# EAGLE design GOTOWAPŁYTKA (EAGLE 9.6.2)
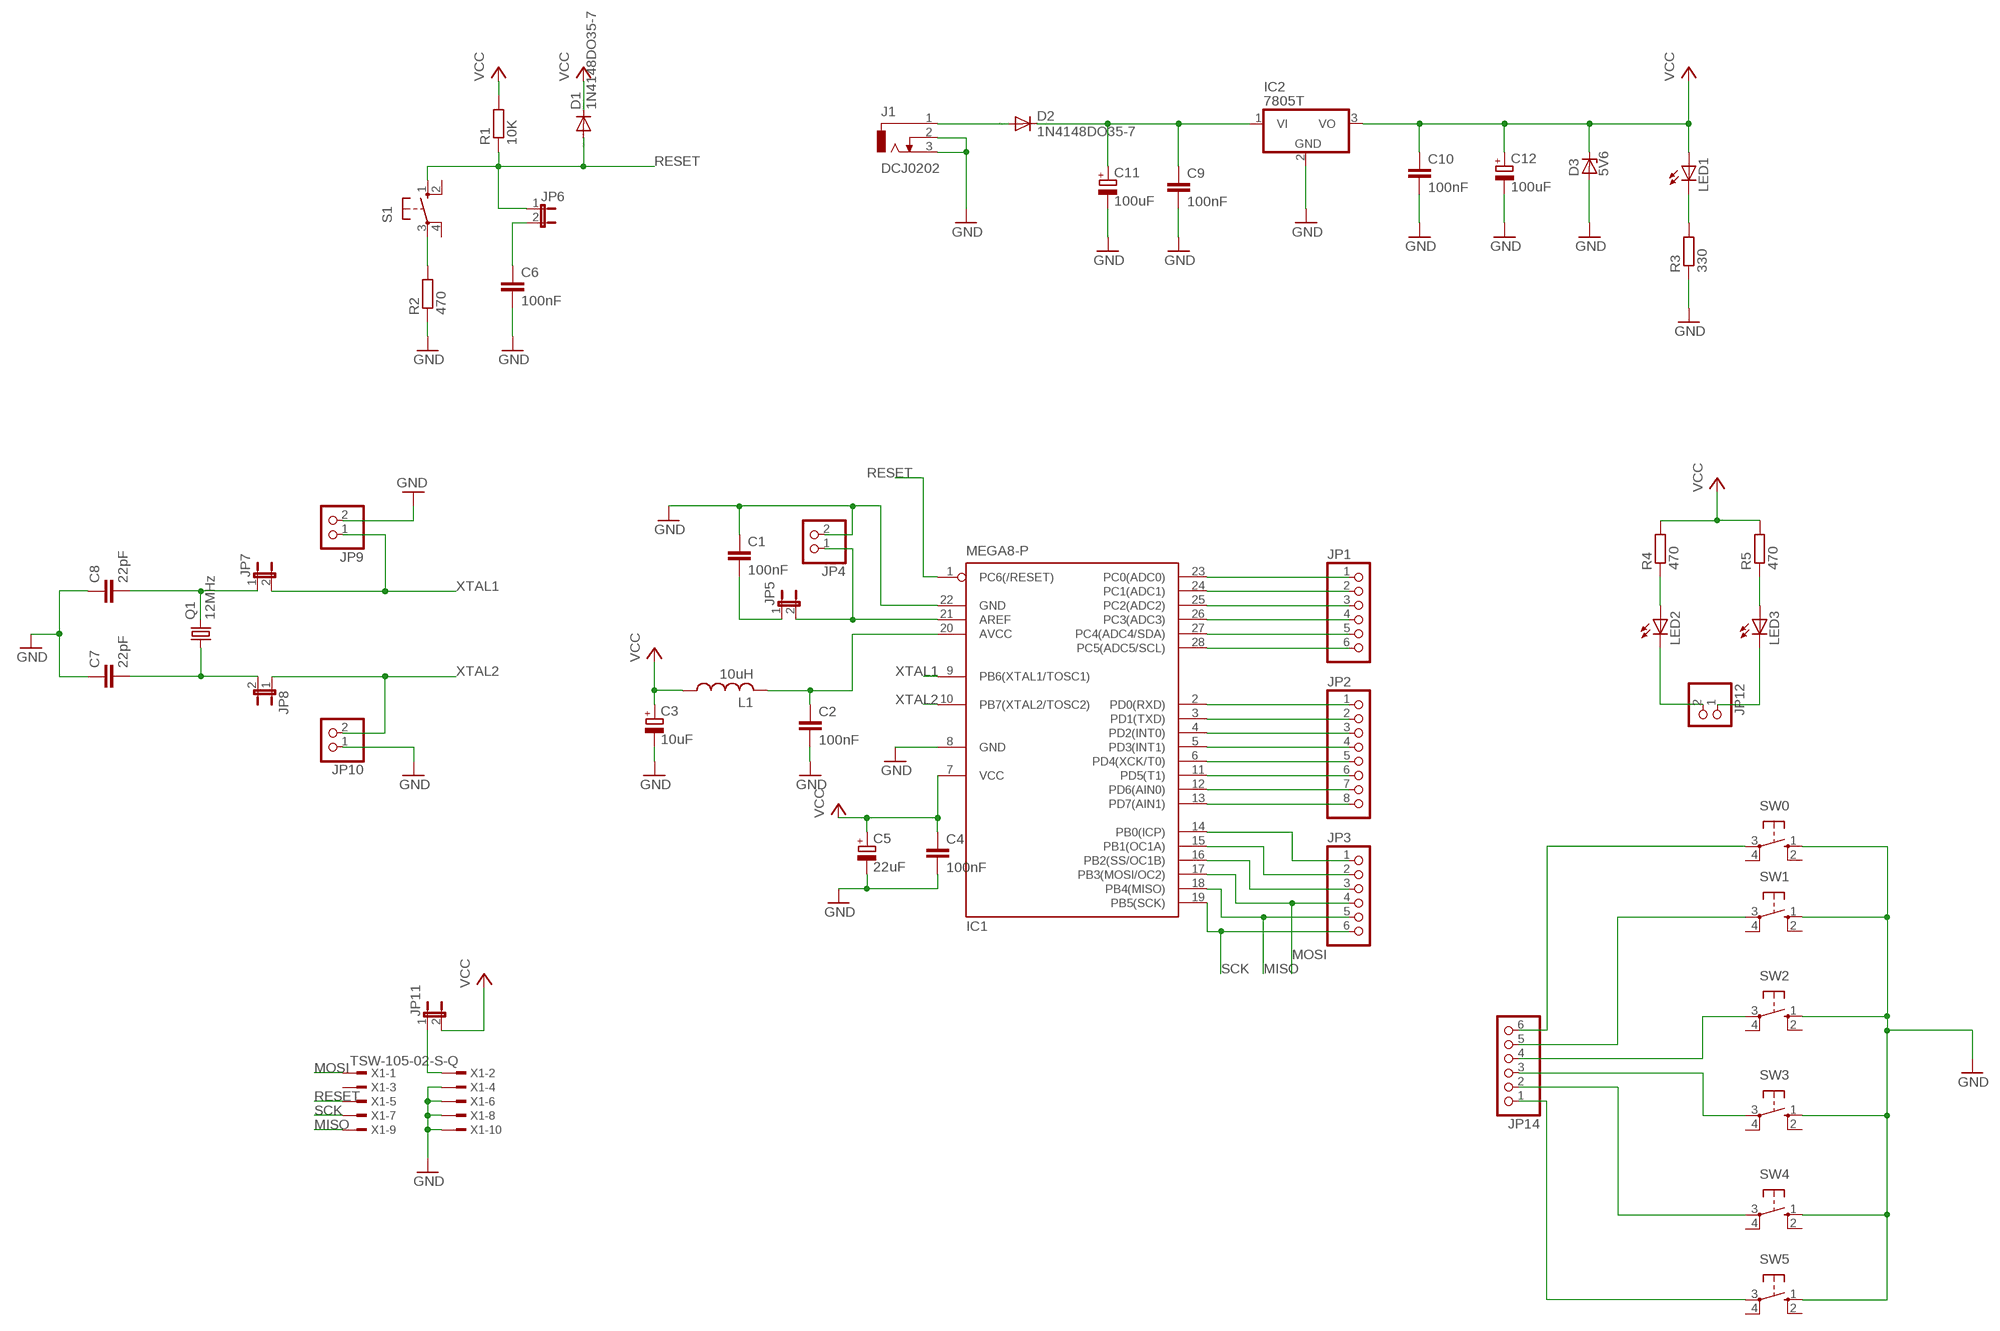
[diagram p0: schematic, sheet 1]

## Parts
C1  100nF  C-EU025-025X050  [C025-025X050]
C2  100nF  C-EU025-025X050  [C025-025X050]
C3  10uF  CPOL-EUB45181B  [B45181B]
C4  100nF  C-EU025-025X050  [C025-025X050]
C5  22uF  CPOL-EUB45181B  [B45181B]
C6  100nF  C-EU025-025X050  [C025-025X050]
C7  22pF  C-EU025-025X050  [C025-025X050]
C8  22pF  C-EU025-025X050  [C025-025X050]
C9  100nF  C-EU025-025X050  [C025-025X050]
C10  100nF  C-EU025-025X050  [C025-025X050]
C11  100uF  CPOL-EUB45181B  [B45181B]
C12  100uF  CPOL-EUB45181B  [B45181B]
D1  1N4148DO35-7  [DO35-7]
D2  1N4148DO35-7  [DO35-7]
D3  5V6  ZENER-DIODEC1702-15  [C1702-15]
IC1  MEGA8-P  [DIL28-3]
IC2  7805T  [TO220H]
J1  DCJ0202  [DCJ0202]
JP1  PINHD-1X6  [1X06]
JP2  PINHD-1X8  [1X08]
JP3  PINHD-1X6  [1X06]
JP4  PINHD-1X2  [1X02]
JP5  JP1E  [JP1]
JP6  JP1E  [JP1]
JP7  JP1E  [JP1]
JP8  JP1E  [JP1]
JP9  PINHD-1X2  [1X02]
JP10  PINHD-1X2  [1X02]
JP11  JP1E  [JP1]
JP12  PINHD-1X2  [1X02]
JP14  PINHD-1X6  [1X06]
L1  10uH  L-US0204/7  [0204/7]
LED1  LED5MM  [LED5MM]
LED2  LED5MM  [LED5MM]
LED3  LED5MM  [LED5MM]
Q1  12MHz  CRYSTALHC49U-V  [HC49U-V]
R1  10K  R-EU_0204/7  [0204/7]
R2  470  R-EU_0204/7  [0204/7]
R3  330  R-EU_0204/7  [0204/7]
R4  470  R-EU_0204/7  [0204/7]
R5  470  R-EU_0204/7  [0204/7]
S1  10-XX  [B3F-10XX]
SW0  10-XX  [B3F-10XX]
SW1  10-XX  [B3F-10XX]
SW2  10-XX  [B3F-10XX]
SW3  10-XX  [B3F-10XX]
SW4  10-XX  [B3F-10XX]
SW5  10-XX  [B3F-10XX]
X1  TSW-105-02-S-Q  [TSW-105-02-S-Q]

## Nets
GND: C1.1 C2.2 C3.- C4.2 C5.- C6.2 C7.1 C8.1 C9.2 C10.2 C11.- C12.- D3.A IC1.8(GND) IC1.22(GND) IC2.2(GND) J1.2 J1.3 JP4.2 JP9.2 JP10.1 R2.1 R3.1 SW0.1(S) SW1.1(S) SW2.1(S) SW3.1(S) SW4.1(S) SW5.1(S) X1.4 X1.6 X1.8 X1.10
MISO: IC1.18(PB4(MISO)) JP3.5 X1.9
MOSI: IC1.17(PB3(MOSI/OC2)) JP3.4 X1.1
N$1: C2.1 IC1.20(AVCC) L1.2
N$2: C8.2 JP7.1 Q1.2
N$3: C7.2 JP8.2 Q1.1
N$4: JP11.1 X1.2
N$5: IC1.21(AREF) JP4.1 JP5.2
N$6: C1.2 JP5.1
N$7: LED1.K(C) R3.2
N$8: D2.A J1.1
N$9: IC1.23(PC0(ADC0)) JP1.1
N$10: IC1.24(PC1(ADC1)) JP1.2
N$11: IC1.25(PC2(ADC2)) JP1.3
N$12: IC1.26(PC3(ADC3)) JP1.4
N$13: IC1.27(PC4(ADC4/SDA)) JP1.5
N$14: IC1.28(PC5(ADC5/SCL)) JP1.6
N$15: IC1.2(PD0(RXD)) JP2.1
N$16: IC1.3(PD1(TXD)) JP2.2
N$17: IC1.4(PD2(INT0)) JP2.3
N$18: IC1.5(PD3(INT1)) JP2.4
N$19: IC1.6(PD4(XCK/T0)) JP2.5
N$20: IC1.11(PD5(T1)) JP2.6
N$21: IC1.12(PD6(AIN0)) JP2.7
N$22: IC1.13(PD7(AIN1)) JP2.8
N$23: IC1.14(PB0(ICP)) JP3.1
N$24: IC1.15(PB1(OC1A)) JP3.2
N$25: IC1.16(PB2(SS/OC1B)) JP3.3
N$26: C9.1 C11.+ D2.C IC2.1(VI)
N$27: JP12.1 LED3.K(C)
N$28: LED3.A R5.1
N$29: R2.2 S1.3(P)
N$30: C6.1 JP6.2
N$31: JP12.2 LED2.K(C)
N$32: LED2.A R4.1
N$33: JP14.5 SW1.3(P)
N$34: JP14.4 SW2.3(P)
N$35: JP14.3 SW3.3(P)
N$36: JP14.2 SW4.3(P)
N$38: JP14.6 SW0.3(P)
N$39: JP14.1 SW5.3(P)
RESET: D1.A IC1.1(PC6(/RESET)) JP6.1 R1.1 S1.1(S) X1.5
SCK: IC1.19(PB5(SCK)) JP3.6 X1.7
VCC: C3.+ C4.1 C5.+ C10.1 C12.+ D1.C D3.C IC1.7(VCC) IC2.3(VO) JP11.2 L1.1 LED1.A R1.2 R4.2 R5.2
XTAL1: IC1.9(PB6(XTAL1/TOSC1)) JP7.2 JP9.1
XTAL2: IC1.10(PB7(XTAL2/TOSC2)) JP8.1 JP10.2
Unconnected: S1.2(S1) S1.4(P1) SW0.2(S1) SW0.4(P1) SW1.2(S1) SW1.4(P1) SW2.2(S1) SW2.4(P1) SW3.2(S1) SW3.4(P1) SW4.2(S1) SW4.4(P1) SW5.2(S1) SW5.4(P1) X1.3

## Library data of the parts
C1 = rcl:C-EU: CAPACITOR, European symbol
C2 C4 C6-C10 = resistor:C-EU: CAPACITOR, European symbol
C3 C5 C11 C12 = resistor:CPOL-EU: POLARIZED CAPACITOR, European symbol
D1 D2 = diode:1N4148: DIODE high speed (Philips)
D3 = diode:ZENER-DIODE: Z-Diode
IC1 = atmel:MEGA8-P: MICROCONTROLLER 8 Kbytes FLASH, 1 kbytes SRAM, 512 bytes EEPROM, USART, 4-channel 10 bit ADC, 2-channel 8 bit ADC Pin compatible with Atmega48, ATMega88, ATMega168 Source: avr.lbr; OC_FARNELL: unknown; OC_NEWARK: unknown
IC2 = linear:78*: Positive VOLTAGE REGULATOR Source: http://cache.national.com/ds/LM/LM78L05.pdf http://www.fairchildsemi.com/ds/LM/LM7805.pdf
J1 = con-jack:DCJ0202: DC POWER JACK Source: DCJ0202.pdf; OC_FARNELL: unknown; OC_NEWARK: unknown
JP1 JP3 JP14 = pinhead:PINHD-1X6: PIN HEADER
JP2 = pinhead:PINHD-1X8: PIN HEADER
JP4 JP9 JP10 JP12 = pinhead:PINHD-1X2: PIN HEADER
JP5-JP8 JP11 = jumper:JP1E: JUMPER
L1 = rcl:L-US: INDUCTOR, American symbol
LED1-LED3 = led:LED: LED OSRAM: - CHIPLED LG R971, LG N971, LY N971, LG Q971, LY Q971, LO R971, LY R971 LH N974, LH R974 LS Q976, LO Q976, LY Q976 LO Q996 - Hyper CHIPLED LW Q18S LB Q993, LB Q99A, LB R99A - SideLED LS A670, LO A670, LY A670, LG A670, LP A670 LB A673, LV A673, LT A673, LW A673 LH A674 LY A675 LS A676, LA A676, LO A676, LY A676, LW A676 LS A679, LY A679, LG A679 - Hyper Micro SIDELED® LS Y876, LA Y876, LO Y876, LY Y876 LT Y87S - SmartLED LW L88C, LW L88S LB L89C, LB L89S, LG L890 LS L89K, LO L89K, LY L89K LS L896, LA L896, LO L896, LY L896 - TOPLED LS T670, LO T670, LY T670, LG T670, LP T670 LSG T670, LSP T670, LSY T670, LOP T670, LYG T670 LG T671, LOG T671, LSG T671 LB T673, LV T673, LT T673, LW T673 LH T674 LS T676, LA T676, LO T676, LY T676, LB T676, LH T676, LSB T676, LW T676 LB T67C, LV T67C, LT T67C, LS T67K, LO T67K, LY T67K, LW E67C LS E67B, LA E67B, LO E67B, LY E67B, LB E67C, LV E67C, LT E67C LW T67C LS T679, LY T679, LG T679 LS T770, LO T770, LY T770, LG T770, LP T770 LB T773, LV T773, LT T773, LW T773 LH T774 LS E675, LA E675, LY E675, LS T675 LS T776, LA T776, LO T776, LY T776, LB T776 LHGB T686 LT T68C, LB T68C - Hyper Mini TOPLED® LB M676 - Mini TOPLED Santana® LG M470 LS M47K, LO M47K, LY M47K Source: http://www.osram.convergy.de LUXEON: - LUMILED® LXK2-PW12-R00, LXK2-PW12-S00, LXK2-PW14-U00, LXK2-PW14-V00 LXK2-PM12-R00, LXK2-PM12-S00, LXK2-PM14-U00 LXK2-PE12-Q00, LXK2-PE12-R00, LXK2-PE12-S00, LXK2-PE14-T00, LXK2-PE14-U00 LXK2-PB12-K00, LXK2-PB12-L00, LXK2-PB12-M00, LXK2-PB14-N00, LXK2-PB14-P00, LXK2-PB14-Q00 LXK2-PR12-L00, LXK2-PR12-M00, LXK2-PR14-Q00, LXK2-PR14-R00 LXK2-PD12-Q00, LXK2-PD12-R00, LXK2-PD12-S00 LXK2-PH12-R00, LXK2-PH12-S00 LXK2-PL12-P00, LXK2-PL12-Q00, LXK2-PL12-R00 Source: www.luxeon.com KINGBRIGHT: KA-3528ASYC Source: www.kingbright.com
Q1 = crystal:CRYSTAL: CRYSTAL; OC_FARNELL: 1666969; OC_NEWARK: unknown
R1-R5 = rcl:R-EU_: RESISTOR, European symbol
S1 SW0 SW1-SW5 = switch-omron:10-XX: OMRON SWITCH; MPN: B3F-1000; OC_FARNELL: 176432; OC_NEWARK: 36M3542
X1 = con-samtec:TSW-105-02-S-Q: THROUGH-HOLE .025" SQ POST HEADER Source: Samtec TSW.pdf; OC_FARNELL: unknown; OC_NEWARK: unknown

## Board
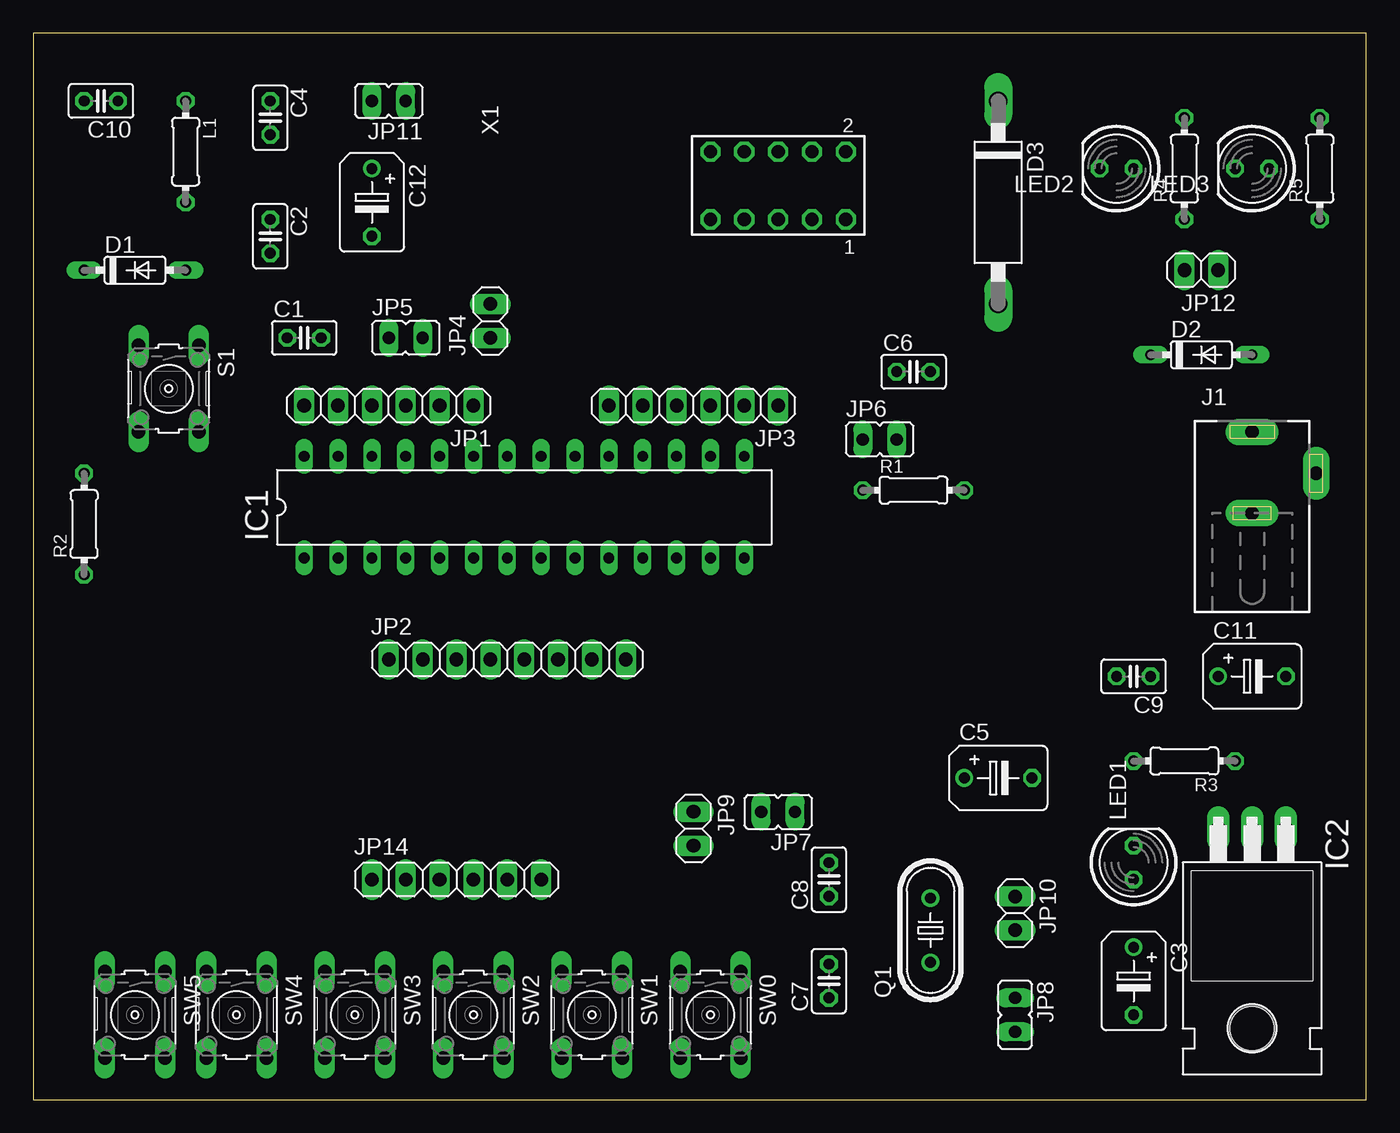
[diagram p1: board, top side]
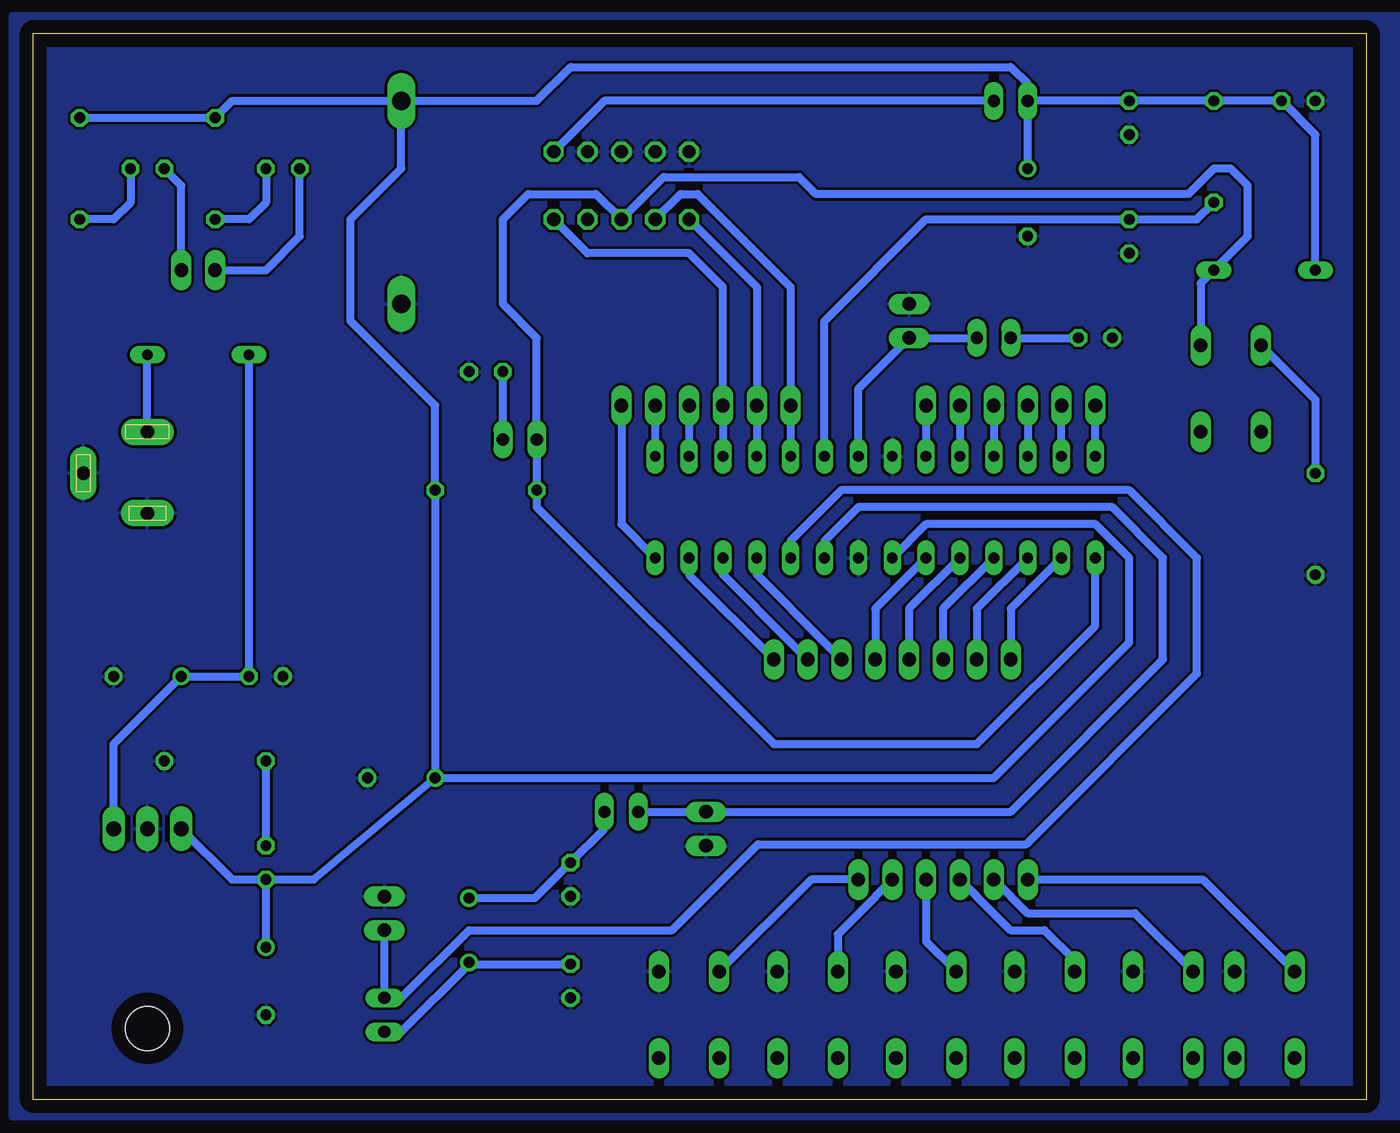
[diagram p2: board, bottom side, seen from below]

Size 100 x 80 mm. Coordinates in mm from the lower left corner, seen from the top.
Outline: 0,0 100,0 100,80 0,80 0,0
Copper layers (1*16): Top 0.035mm / dielectric 1.5mm / Bottom 0.035mm
Design rules "default": minimum track width 10mil, minimum drill 24mil, track to track 8mil, track to pad 8mil, pad to pad 8mil, via to via 8mil, smd to smd 8mil, copper to edge 40mil, drill to drill 8mil, minimum pad ring 10mil, minimum via ring 8mil, stop-mask expansion 4mil, vias tented up to drill 0mil, thermal gap 10mil

### Footprints (pad centres in the part's own frame; a part is rotated, then mirrored left to right if it is on the bottom)
C025-025X050 = drill 0.813 octagon: 1 -1.27,0; 2 1.27,0
B45181B = drill 0.813: + -2.54,0 | drill 0.813 octagon: - 2.54,0
DO35-7 = drill 0.813 long: A 3.81,0; C -3.81,0
C1702-15 = drill 1.397 long: A 7.62,0; C -7.62,0
DIL28-3 = drill 0.813 long: 1 -16.51,-3.81; 2 -13.97,-3.81; 3 -11.43,-3.81; 4 -8.89,-3.81; 5 -6.35,-3.81; 6 -3.81,-3.81; 7 -1.27,-3.81; 8 1.27,-3.81; 9 3.81,-3.81; 10 6.35,-3.81; 11 8.89,-3.81; 12 11.43,-3.81; 13 13.97,-3.81; 14 16.51,-3.81; 15 16.51,3.81; 16 13.97,3.81; 17 11.43,3.81; 18 8.89,3.81; 19 6.35,3.81; 20 3.81,3.81; 21 1.27,3.81; 22 -1.27,3.81; 23 -3.81,3.81; 24 -6.35,3.81; 25 -8.89,3.81; 26 -11.43,3.81; 27 -13.97,3.81; 28 -16.51,3.81
TO220H = drill 1.118 long: 1 -2.54,-10.16; 2 0,-10.16; 3 2.54,-10.16 | hole 3.302: 0,4.826
DCJ0202 = drill 1 pad 2 long: 1 0,3.1; 2 4.8,0; 3 0,-3
1X06 = drill 1.016 long: 1 -6.35,0; 2 -3.81,0; 3 -1.27,0; 4 1.27,0; 5 3.81,0; 6 6.35,0
1X08 = drill 1.016 long: 1 -8.89,0; 2 -6.35,0; 3 -3.81,0; 4 -1.27,0; 5 1.27,0; 6 3.81,0; 7 6.35,0; 8 8.89,0
1X02 = drill 1.016 long: 1 -1.27,0; 2 1.27,0
JP1 = drill 0.914 long: 1 0,-1.27; 2 0,1.27
0204/7 = drill 0.813 octagon: 1 -3.81,0; 2 3.81,0
LED5MM = drill 0.813 octagon: A -1.27,0; K 1.27,0
HC49U-V = drill 0.813: 1 -2.413,0; 2 2.413,0
B3F-10XX = drill 1.016 long: 1 -3.251,2.261; 2 3.251,2.261; 3 -3.251,-2.261; 4 3.251,-2.261
TSW-105-02-S-Q = drill 1 pad 1.5 octagon: 1 5.08,-2.54; 2 5.08,2.54; 3 2.54,-2.54; 4 2.54,2.54; 5 0,-2.54; 6 0,2.54; 7 -2.54,-2.54; 8 -2.54,2.54; 9 -5.08,-2.54; 10 -5.08,2.54

### Placement (x,y rotation side)
C1  20.32,57.15 0 top
C2  17.78,64.77 270 top
C3  82.55,8.89 270 top
C4  17.78,73.66 270 top
C5  72.39,24.13 0 top
C6  66.04,54.61 0 top
C7  59.69,8.89 90 top
C8  59.69,16.51 90 top
C9  82.55,31.75 180 top
C10  5.08,74.93 180 top
C11  91.44,31.75 0 top
C12  25.4,67.31 270 top
D1  7.62,62.23 0 top
D2  87.63,55.88 0 top
D3  72.39,67.31 270 top
IC1  36.83,44.45 0 top
IC2  91.44,10.16 180 top
J1  91.44,46.99 0 top
JP1  26.67,52.07 180 top
JP2  35.56,33.02 0 top
JP3  49.53,52.07 180 top
JP4  34.29,58.42 90 top
JP5  27.94,57.15 270 top
JP6  63.5,49.53 270 top
JP7  55.88,21.59 90 top
JP8  73.66,6.35 180 top
JP9  49.53,20.32 270 top
JP10  73.66,13.97 270 top
JP11  26.67,74.93 90 top
JP12  87.63,62.23 180 top
JP14  31.75,16.51 0 top
L1  11.43,71.12 270 top
LED1  82.55,17.78 90 top
LED2  81.28,69.85 180 top
LED3  91.44,69.85 180 top
Q1  67.31,12.7 90 top
R1  66.04,45.72 0 top
R2  3.81,43.18 90 top
R3  86.36,25.4 180 top
R4  86.36,69.85 90 top
R5  96.52,69.85 90 top
S1  10.16,53.34 270 top
SW0  50.8,6.35 270 top
SW1  41.91,6.35 270 top
SW2  33.02,6.35 270 top
SW3  24.13,6.35 270 top
SW4  15.24,6.35 270 top
SW5  7.62,6.35 270 top
X1  55.88,68.58 0 top

### Tracks (layer width: path | path; a pad name or v marks a point on that pad's centre or on a via)
GND
  pour Bottom (isolate 0.406): 1.27,78.74 99.06,78.74 99.06,1.27 1.27,1.27
MISO
  Bottom 0.61: IC1.18 JP3.5 45.72,60.98 45.74,60.98 X1.9
MOSI
  Bottom 0.61: IC1.17 JP3.4 48.26,60.96 50.8,63.5 58.42,63.5 X1.1
N$1
  Bottom 0.61: IC1.20 40.64,58.42 33.02,66.04 C2.1 12.7,66.04 L1.2
N$2
  Bottom 0.61: 67.44,15.24 Q1.2 62.36,15.11 C8.2 57.15,20.32 JP7.1
N$3
  Bottom 0.61: 67.25,10.22 67.18,10.16 C7.2 | 67.44,10.16 Q1.1 67.25,10.22 | JP8.2 72.39,5.08 67.25,10.22
N$4
  Bottom 0.61: JP11.1 57.15,74.93 X1.2
N$5
  Bottom 0.61: IC1.21 38.1,53.34 JP4.1 JP5.2
N$6
  Bottom 0.61: JP5.1 C1.2
N$7
  Bottom 0.61: LED1.K R3.2
N$8
  Bottom 0.61: J1.1 D2.A
N$9
  Bottom 0.61: JP1.1 IC1.23
N$10
  Bottom 0.61: JP1.2 IC1.24
N$11
  Bottom 0.61: JP1.3 IC1.25
N$12
  Bottom 0.61: JP1.4 IC1.26
N$13
  Bottom 0.61: IC1.27 JP1.5
N$14
  Bottom 0.61: IC1.28 JP1.6
N$15
  Bottom 0.61: IC1.2 26.67,36.83 JP2.1
N$16
  Bottom 0.61: IC1.3 29.21,36.83 JP2.2
N$17
  Bottom 0.61: IC1.4 31.75,36.83 JP2.3
N$18
  Bottom 0.61: IC1.5 34.29,36.83 JP2.4
N$19
  Bottom 0.61: IC1.6 36.83,36.83 JP2.5
N$20
  Bottom 0.61: JP2.6 40.64,34.29 40.64,34.31 45.72,39.39 IC1.11
N$21
  Bottom 0.61: JP2.7 43.18,34.29 43.18,34.31 48.26,39.39 IC1.12
N$22
  Bottom 0.61: IC1.13 50.8,39.37 JP2.8
N$23
  Bottom 0.61: JP3.1 55.88,43.18 IC1.14
N$24
  Bottom 0.61: JP3.2 IC1.15
N$25
  Bottom 0.61: JP3.3 IC1.16
N$26
  Bottom 0.61: IC2.1 93.98,26.67 C11.+ C9.1 D2.C
N$27
  Bottom 0.61: JP12.1 88.9,68.58 LED3.K
N$28
  Bottom 0.61: LED3.A 92.71,67.31 93.98,66.04 R5.1
N$29
  Bottom 0.61: S1.3 3.81,52.5 R2.2
N$30
  Bottom 0.61: JP6.2 C6.1
N$31
  Bottom 0.61: JP12.2 82.55,62.23 80.01,64.77 LED2.K
N$32
  Bottom 0.61: LED2.A 82.55,67.31 83.82,66.04 R4.1
N$33
  Bottom 0.61: JP14.5 36.83,15.24 36.83,15.22 39.65,12.4 SW1.3
N$34
  Bottom 0.61: JP14.4 33.02,11.86 SW2.3
N$35
  Bottom 0.61: JP14.3 29.21,15.24 29.21,15.22 26.69,12.7 24.13,12.7 21.87,10.44 SW3.3
N$36
  Bottom 0.61: JP14.2 26.67,15.24 26.67,15.22 25.42,13.97 17.35,13.97 SW4.3
N$37
  pour Bottom: -2.54,81.28 101.6,81.28 101.6,-1.27 -2.54,-1.27
N$38
  Bottom 0.61: JP14.6 41.63,16.51 SW0.3
N$39
  Bottom 0.61: SW5.3 12.27,16.51 JP14.1
RESET
  Bottom 0.61: IC1.1 20.32,35.54 29.19,26.67 44.45,26.67 62.23,44.45 R1.1 JP6.1 62.23,57.15 64.77,59.69 64.77,66.04 62.87,67.94 57.78,67.94 X1.5 52.7,69.22 42.55,69.22 41.27,67.94 13.34,67.94 11.43,69.85 10.16,69.85 8.89,68.58 8.89,64.77 D1.A 12.42,61.24 S1.1
SCK
  Bottom 0.61: IC1.19 JP3.6 43.18,60.96 50.16,67.94 51.44,67.94 X1.7
VCC
  Bottom 0.61: R5.2 R4.2 85.09,74.93 D3.C | C12.+ JP11.2 | C5.+ R1.2 69.85,52.07 76.2,58.42 76.2,66.04 72.39,69.85 D3.C | D1.C 3.81,72.39 C10.1 L1.1 C4.1 JP11.2 | C3.+ LED1.A | IC2.3 85.09,16.51 LED1.A | LED1.A 78.97,16.51 C5.+ | JP11.2 25.4,76.2 26.67,77.47 59.69,77.47 62.23,74.93 D3.C | C5.+ 27.94,24.13 17.78,34.29 17.78,40.64 20.32,43.18 33.02,43.18 IC1.7
XTAL1
  Bottom 0.61: JP7.2 JP9.1 26.67,21.59 15.24,33.02 15.24,40.64 19.05,44.45 38.1,44.45 40.64,41.91 IC1.9
XTAL2
  Bottom 0.61: JP10.2 JP8.1 72.39,7.62 67.31,12.7 52.07,12.7 45.62,19.15 25.5,19.15 12.7,31.95 12.7,40.64 17.78,45.72 39.37,45.72 43.18,41.91 IC1.10